# EasyEDA Pro project OptoGrid_V0.05.epro, board OptoGrid_Main_V0.05
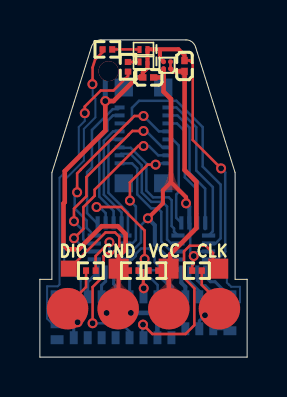
[diagram p7: board, top side]
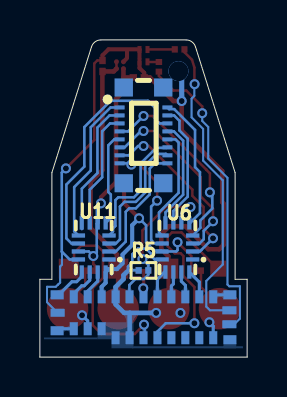
[diagram p8: board, bottom side, seen from below]

Outline 10.4 x 15.9 mm; copper layers: Top Layer, Bottom Layer. Coordinates in mm from the lower left corner of the outline.
Outline path: 0,3.9 0,0 10.4,0 10.4,3.9 9.8,3.9 9.8,9.24 7.81,15.55 arc(7.63,15.8) 7.33,15.9 3.07,15.9 arc(2.77,15.8) 2.59,15.55 0.6,9.24 0.6,3.9 0,3.9
Stack: Top Layer 0.035mm / Dielectric1 0.51mm FR4 er 4.5 / Bottom Layer 0.035mm

## Design rules (mm)
template: 自定义配置
spacing copperThickness1oz (default): track to track 0.102, other pairs 0.099 to 0.3
spacing copperThickness2oz: track to track 0.203, other pairs 0.152 to 0.3
track width copperThickness1oz (default): min 0.102, default 0.254, max 2.54
track width copperThickness2oz: min 0.203, default 0.254, max 2.54
differential pair differentialPair (default): width min 0.127, default 0.254, max 2.54; gap min 0.152, default 0.152
via viaSize (default): diameter min 0.5, default 0.61, max 10; hole min 0.3, default 0.305, max 6.299

## Placement (name value [footprint] x y rotation side)
C46  2.2uF  [C0201]  5.44 14.02 0 top
C54  2.2uF  [C0201]  7.26 14.59 90 top
CLK  -  [Test-Point-0.5mm#4]  8.48 4.63 0 top
CN1  YXT-BB10-16S-02  [CONN-SMD_YXT-BB10-16S-02]  5.2 11.11 90 bottom
DIO  -  [Test-Point-0.5mm]  2.06 4.43 0 top
GND  -  [Test-Point-0.5mm#2]  4.57 4.5 0 top
J1  -  [811-22-004-30-002101]  5.2 2.43 180 top
R2  220Ω  [R0201]  4.43 14.55 270 top
R4  4.7kΩ  [R0201]  2.56 4.33 0 top
R5  71.5Ω  [R0201]  5.2 4.34 180 bottom
R6  82Ω  [R0201]  3.39 15.42 180 top
R7  1MΩ  [R0201]  5.7 4.33 0 top
R8  1MΩ  [R0201]  4.71 4.33 0 top
R9  4.7kΩ  [R0201]  7.88 4.33 180 top
U3  RED LED  [BLUE_LED_KINGBRIGHT_0201]  5.2 14.8 180 top
U5  -  [HY0020_footprint_NoFilling]  5.2 1.95 180 bottom
U6  TMUX1208RSVR  [UTQFN-16_L2.6-W1.8-P0.40-BL]  3.5 5.5 90 bottom
U7  NCP163AFCT330T2G  [WLCSP-4_L0.6-W0.6-P0.35-R2-C2-TL]  6.38 14.63 180 top
U11  TMUX1208RSVR  [UTQFN-16_L2.6-W1.8-P0.40-BL]  7.7 5.5 90 bottom
U12  BLUE LED  [BLUE_LED_KINGBRIGHT_0201]  5.2 15.42 180 top
VCC  -  [Test-Point-0.5mm#3]  5.74 4.44 0 top

## Footprints (pads in the part's own frame, mm; a bottom-side part is the same pattern mirrored in y, then rotated)
811-22-004-30-002101
  round 2.08 smd: 1(-3.81,0) 2(-1.27,0) 3(1.27,0) 4(3.81,0)
BLUE_LED_KINGBRIGHT_0201
  custom 0.2x0.35 smd: 1(-0.2,0.001) 2(0.2,0.001)
C0201
  rect 0.368x0.324 smd: 1(-0.275,0) 2(0.275,0)
CONN-SMD_YXT-BB10-16S-02
  rect 0.2x0.5 smd: 1(1.4,1.2) 2(1.4,-1.2) 3(1,1.2) 4(1,-1.2) 5(0.6,1.2) 6(0.6,-1.2) 7(0.2,1.2) 8(0.2,-1.2) 9(-0.2,1.2) 10(-0.2,-1.2) 11(-0.6,1.2) 12(-0.6,-1.2) 13(-1,1.2) 14(-1,-1.2) 15(-1.4,1.2) 16(-1.4,-1.2)
  rect 0.9x0.92 smd: 17(-2.4,0.99) 18(-2.4,-0.99) 19(2.4,0.99) 20(2.4,-0.99)
HY0020_footprint_NoFilling
  custom 0.4x0.65 smd: 1(-3.5,1.075) 2(-2.8,1.075) 3(-2.1,1.075) 4(-1.4,1.075) 5(-0.7,1.075) 6(0,1.075) 7(0.7,1.075) 8(1.4,1.075) 9(2.1,1.075) 10(2.8,1.075) 11(3.5,1.075) 16(3.5,-0.975) 17(2.8,-0.975) 18(2.1,-0.975) 19(1.4,-0.975) 20(0.7,-0.975) 21(0,-0.975) 22(-0.7,-0.975) 23(-1.4,-0.975) 24(-2.1,-0.525) 25(-2.8,-0.525) 26(-3.5,-0.525)
  custom 0.65x0.45 smd: 12(4.335,1.175) 15(4.335,-1.075) 27(-4.335,-0.625) 29(-4.335,1.175)
  custom 0.7x0.4 smd: 13(4.31,0.4) 14(4.31,-0.3) 28(-4.31,0.275)
R0201
  rect 0.303x0.324 smd: 1(-0.241,0) 2(0.241,0)
Test-Point-0.5mm
  rect 0.8x0.8 smd: 1(-0.615,0)
Test-Point-0.5mm#2
  rect 1x1 smd: 1(-0.617,-0.066)
Test-Point-0.5mm#3
  rect 1x1 smd: 1(0.716,-0.007)
Test-Point-0.5mm#4
  rect 1x1 smd: 1(0.474,-0.198)
UTQFN-16_L2.6-W1.8-P0.40-BL
  rect 0.21x0.665 smd: 1(-0.6,-0.768) 2(-0.2,-0.768) 3(0.2,-0.768) 4(0.6,-0.768) 9(0.6,0.768) 10(0.2,0.768) 11(-0.2,0.768) 12(-0.6,0.768)
  rect 0.665x0.21 smd: 5(1.232,-0.6) 6(1.232,-0.2) 7(1.232,0.2) 8(1.232,0.6) 13(-1.232,0.6) 14(-1.232,0.2) 15(-1.232,-0.2) 16(-1.232,-0.6)
WLCSP-4_L0.6-W0.6-P0.35-R2-C2-TL
  round 0.25 smd: A1(-0.175,0.175) A2(0.175,0.175) B1(-0.175,-0.175) B2(0.175,-0.175)

## Nets
As in the schematic, except:
GND: C46.1 C54.2 CN1.20 GND.1 J1.3 R5.1 R8.1 U3.1 U5.4 U5.15 U5.22 U5.23 U5.24 U5.28 U6.12 U7.B2 U11.12 U12.1
BAT+: C54.1 J1.2 R7.2 U7.A1 U7.B1 VCC.1
SWDCLK: CLK.1 U5.21
SWDIO: DIO.1 U5.20

Pads without a net: CN1 17 18 19; U5 17 18 19; U6 1; U11 1

## Via types
v1: diameter 0.5, hole 0.3, Top Layer to Bottom Layer, 25 vias
v2: diameter 1, hole 1, Top Layer to Bottom Layer, 1 via

## Routing (per net, layer and track width the routed paths; a pad name or vN(x,y) marks a point on that pad's centre or on a via; arc(x,y) is an arc through that point)
GND: length 48
  Top Layer w0.127: v1(9.09,9.46) 7.67,10.88 7.67,14.72 7.52,14.87 7.34,14.87
  Top Layer w0.203: 6.03,15.4 6.03,15.39 6.03,15.01 ; 6.03,14.98 6.18,14.83 ; J1.3 3.95,2.45 3.95,4.43 ; 5.4,14.98 5.4,15.43 6.95,15.43 7.26,15.13 C54.2 ; C46.1 5.16,14.25 5.4,14.49 U3.1
  Top Layer w0.229: 3.95,4.43 3.95,5.05 4.31,5.41 4.31,6.16 3.91,6.56 3.1,6.56 1.95,5.41 1.4,5.41 1.18,5.62 1.18,7.7 1.25,7.77 1.25,9.32 3.28,11.36 v1(3.28,12.83) 3.7,12.83 4.88,14.02 C46.1
  Bottom Layer w0.102: U5.28 10.04,2.75 10.04,3.52 9.6,3.52 9.5,3.63 9.49,3.63 9.38,3.73 9.38,4.54 9.29,4.63 9.29,5.28
  Bottom Layer w0.127: 5.97,4.34 5.96,4.35 5.51,4.35 ; 5.97,4.34 5.97,4.54 5.76,4.76 5.76,5.15 5.47,5.44 5.08,5.44 4.82,5.18 4.82,5.07 4.64,4.89 U6.12 ; 5.97,4.34 6.02,4.3 ; v1(9.09,9.46) 9.3,9.25 9.3,5.29 8.91,4.89 U11.12
  Bottom Layer w0.229: 5.9,2.22 6.17,2.22 6.6,2.64 ; 5.9,2.22 v1(4.57,2.22) ; 5.9,2.22 5.9,0.97 U5.22 ; 6.6,2.65 U5.4 6.6,3.51 6.2,3.91 6.2,4.11 6.02,4.3
  Bottom Layer w0.254: v2(3.45,14.33) 3.28,14.17 v1(3.28,12.83)
  vias: v1(3.35,2.21)
VBAT_ADC: length 1.8
  Top Layer w0.152: 5.19,4.33 R8.2 ; 5.19,4.33 R7.1 ; 5.19,4.33 5.19,3.47 v1(5.21,3.45)
  Bottom Layer w0.127: U5.6 5.21,3.03 v1(5.21,3.45)
VCC: length 24.6
  Top Layer w0.127: R4.2 2.8,5.07 v1(3.49,5.76) ; v1(7.72,5.07) 7.72,4.66 7.64,4.58 R9.2
  Top Layer w0.203: v1(7.34,7.71) 7.34,8.01 6.58,8.77 6.17,8.36 6.17,7.71 v1(5.42,6.96)
  Top Layer w0.229: U7.A2 6.21,14.03 ; 6.21,14.03 6.21,13.31 6.58,12.93 6.58,8.77 ; 6.21,14.03 6.19,14.02 C46.2
  Bottom Layer w0.127: U11.6 7.54,6.68 7.54,5.24 v1(7.72,5.07) 7.95,5.3 8.46,5.3 ; v1(5.42,6.96) 5.07,6.61 5.07,5.76 4.64,5.33 4.3,5.33 U6.11 3.56,5.3 3.49,5.36 v1(3.49,5.76)
  Bottom Layer w0.203: v1(7.34,7.71) 7.5,7.55 U11.6 ; U5.3 7.3,3.52 7.1,3.73 U11.16 6.95,4.41 6.54,4.41 6.25,4.69 6.25,5.14 5.77,5.62 5.77,6.61 v1(5.42,6.96)
AX0: length 1.3
  Bottom Layer w0.152: U5.9 3.09,3.03 3.09,3.59 3.3,3.8 U6.15
AX1: length 1.3
  Bottom Layer w0.152: U6.14 3.7,3.67 3.8,3.57 U5.8
AX2: length 1.4
  Bottom Layer w0.152: U5.7 4.5,3.03 4.5,3.9 4.14,4.26 U6.13
AY0: length 1.4
  Bottom Layer w0.152: U5.2 8,3.3 7.5,3.81 U11.15
AY1: length 1.6
  Bottom Layer w0.152: U11.14 7.9,3.85 8.17,3.57 8.3,3.57 8.7,3.18 U5.1
AY2: length 1.8
  Bottom Layer w0.152: U11.13 8.3,4.04 8.56,3.78 8.79,3.78 9.45,3.12 U5.29
BAT+: length 13.5
  Top Layer w0.127: U7.A1 U7.B1
  Top Layer w0.229: 6.53,4.68 6.53,5.15 7.85,6.47 7.85,8.78 7.26,9.37 7.26,14.32 6.69,14.32 6.56,14.45 ; VCC.1 6.47,4.42 J1.2
CURRENT_SENSING_ADC: length 8.1
  Top Layer w0.127: v1(5.26,4.92) 5.26,6.35 4.08,7.52 v1(2.84,7.52)
  Bottom Layer w0.127: U6.6 3.3,7.22 3,7.52 v1(2.84,7.52) ; U5.5 5.91,3.03 5.91,3.61 5.61,3.91 5.18,3.91 4.96,4.13 R5.2 4.96,4.62 v1(5.26,4.92)
MUX_EN_PWM: length 1.4
  Bottom Layer w0.152: U6.16 2.4,3.76 U5.10
SCL: length 3.1
  Top Layer w0.127: R9.1 8.12,3.61 9.01,2.73 J1.1
  Bottom Layer w0.152: v1(8.28,2.1) 8,1.81 U5.25
SDA: length 3.1
  Top Layer w0.127: R4.1 2.32,3.51 1.39,2.58 J1.4
  Bottom Layer w0.152: U5.16 1.7,1.55 v1(1.89,1.75)
SHAM_LED: length 15.4
  Top Layer w0.127: R6.2 3.15,15.28 2.77,14.91 2.64,14.51 2.64,13.69 v1(2.64,13.68)
  Bottom Layer w0.102: 2.63,13.68 2.65,13.66 2.65,13.09 2.79,12.96 2.79,12.02 2.21,11.44 2.21,9.85 1.22,8.86 1.22,4.64 2.05,3.82 2.05,2.53 1.87,2.35 0.88,2.35
STATUS_LED: length 15.4
  Top Layer w0.127: R2.2 4.43,14.09 3.69,13.36 3.05,13.36 2.25,12.56 v1(2.25,12.23)
  Bottom Layer w0.102: v1(2.25,12.23) 2.25,11.84 1.95,11.54 1.95,9.95 0.99,8.99 0.99,3.64 0.9,3.55 0.36,3.55 0.36,1.93 0.65,1.65 U5.14
SWDCLK: length 10.3
  Top Layer w0.127: CLK.1 8.69,4.7 8.69,5.22 8.32,5.58 7.52,5.58 7.23,5.3 7.23,3.97 7.75,3.45 7.75,1.6 7.31,1.16 5.64,1.16 v1(5.17,1.63) ; 8.56,4.82 8.56,4.8
  Bottom Layer w0.127: 5.21,0.94 5.14,1 5.14,1.67
SWDIO: length 10.8
  Top Layer w0.127: v1(2.65,1.7) 2.65,3.51 3.2,4.06 3.2,5.07 3.33,5.2 3.63,5.2 3.98,5.55 3.98,6.04 3.77,6.25 3.29,6.25 1.48,4.43 DIO.1
  Bottom Layer w0.127: U5.20 4.5,1.28 4.08,1.7 v1(2.65,1.7)
X1: length 6.9
  Bottom Layer w0.127: CN1.2 3.92,12.43 3.66,12.43 2.61,11.39 2.61,9.52 2.37,9.27 2.37,7.22 2.86,6.73 2.9,6.73
X2: length 6.2
  Bottom Layer w0.127: 3.7,6.87 3.7,7.33 2.98,8.04 2.98,10.95 3.4,11.36 3.4,11.84 3.67,12.11 CN1.4
X3: length 5.3
  Bottom Layer w0.127: 4.1,6.87 4.1,7.25 3.21,8.14 3.21,10.85 3.67,11.31 CN1.8
X4: length 5.8
  Bottom Layer w0.127: U6.9 4.42,6.25 4.42,7.25 3.44,8.23 3.44,10.76 3.6,10.91 CN1.10
X5: length 9.6
  Top Layer w0.127: 5.2,12.09 4.74,12.09 2.06,9.4 2.06,9.4 1.87,9.21 v1(1.87,8.26)
  Bottom Layer w0.127: CN1.7 5.97,11.31 v1(5.2,12.09) ; v1(1.87,8.26) 1.75,8.14 1.75,7.45 2.35,6.85 2.35,6.48 U6.4
X6: length 5.9
  Top Layer w0.127: v1(4.52,7.84) 4.52,8.76 5.41,9.65 v1(5.81,9.65)
  Bottom Layer w0.127: CN1.15 5.87,9.71 v1(5.81,9.65) ; v1(4.52,7.84) 4.82,7.54 4.82,5.87 4.64,5.69 U6.10
X7: length 9.6
  Top Layer w0.127: v1(1.71,6.81) 1.71,7.44 2.33,8.06 2.33,9.02 4.46,11.14 4.46,11.15 4.64,11.33 v1(5.2,11.33)
  Bottom Layer w0.127: CN1.11 6.15,10.51 5.32,11.33 v1(5.2,11.33) ; v1(1.71,6.81) 1.71,6.79 2.18,6.33 2.18,5.91 2.39,5.69 U6.3
X8: length 8.9
  Top Layer w0.127: v1(1.71,5.96) 2.19,6.43 2.19,7.52 2.75,8.09 2.75,8.4 4.94,10.59 5.19,10.59
  Bottom Layer w0.127: 2.76,5.29 2.38,5.29 2.31,5.36 2.31,5.36 v1(1.71,5.96) ; CN1.13 5.94,10.11 5.47,10.58 v1(5.2,10.58)
Y1: length 7.7
  Bottom Layer w0.127: U11.9 8.68,6.31 8.68,8.52 7.85,9.35 7.85,11.52 6.85,12.51 CN1.1
Y2: length 6.8
  Bottom Layer w0.127: 8.29,6.41 8.29,8.44 7.51,9.22 7.51,11.51 6.9,12.11 CN1.3
Y3: length 5.9
  Bottom Layer w0.127: 6.4,11.71 6.88,11.71 7.27,11.32 7.27,9.01 7.89,8.39 7.89,7.19 7.9,7.19 U11.7
Y4: length 12.2
  Bottom Layer w0.127: CN1.6 4.4,11.71 4.62,11.94 4.62,12.49 4.98,12.85 6.85,12.85 8.17,11.53 8.17,9.55 9.07,8.65 9.07,5.95 8.81,5.69 U11.10
Y5: length 4.7
  Bottom Layer w0.127: CN1.9 6.67,10.91 6.97,10.61 6.97,8.28 6.84,8.15 6.84,6.98 U11.5
Y6: length 6.6
  Bottom Layer w0.127: CN1.14 4.07,10.19 4.54,10.19 5.11,9.61 5.11,8.25 5.58,7.78 6.15,7.78 6.38,7.55 6.38,5.9 6.59,5.69 U11.3
Y7: length 6.4
  Bottom Layer w0.127: CN1.16 4.63,9.71 4.89,9.45 4.89,8.16 5.58,7.46 5.92,7.46 6.09,7.28 6.09,5.79 6.59,5.29 6.93,5.29
Y8: length 6.4
  Bottom Layer w0.127: CN1.12 4.02,10.49 4.56,10.49 5.34,9.7 5.34,8.35 5.68,8.01 6.47,8.01 6.61,7.87 6.61,6.57 6.73,6.45 6.73,6.29 U11.4
$1N29965: length 0.9
  Bottom Layer w0.152: U5.26 9.44,1.42 U5.27
$1N29971: length 0.9
  Bottom Layer w0.152: U5.12 1.6,3.12 U5.11
$1N46797: length 0.6
  Top Layer w0.127: 4.43,14.79 4.99,14.79 U3.2
$1N46842: length 1.4
  Top Layer w0.127: U12.2 4.99,15.42 R6.1

## Copper pours and planes (outline as drawn; the poured copper is in the pictures)
GND on Bottom Layer: 5.7,1.75 7.5,1.75 7.5,0.44 5.7,0.44

Small or netless copper shapes (teardrops, artwork), in the pictures only: 36 on Top Layer, 81 on Bottom Layer
